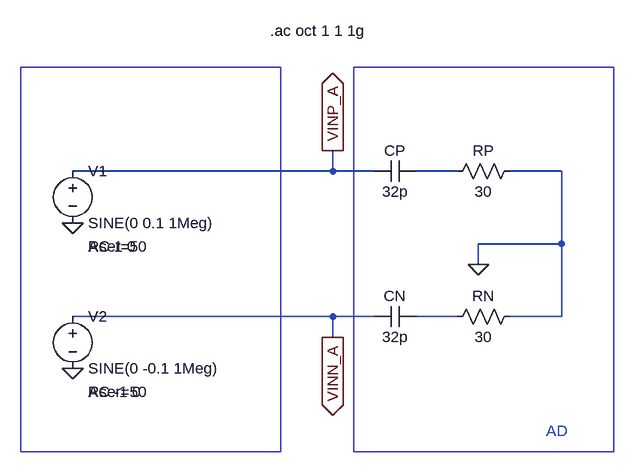
[diagram p0: schematic AD.asc]
AD.asc, the LTspice schematic file:
Version 4
SHEET 1 1456 680
WIRE 592 48 592 16
WIRE 592 48 192 48
WIRE 656 48 592 48
WIRE 784 48 720 48
WIRE 944 48 864 48
WIRE 944 160 944 48
WIRE 944 160 816 160
WIRE 816 192 816 160
WIRE 592 272 192 272
WIRE 656 272 592 272
WIRE 784 272 720 272
WIRE 944 272 944 160
WIRE 944 272 864 272
WIRE 592 304 592 272
FLAG 592 304 VINN_A
IOPIN 592 304 Out
FLAG 592 16 VINP_A
IOPIN 592 16 Out
FLAG 816 192 0
FLAG 192 128 0
FLAG 192 352 0
SYMBOL cap 720 32 R90
WINDOW 0 0 32 VBottom 0
WINDOW 3 32 32 VTop 0
SYMATTR InstName CP
SYMATTR Value 32p
SYMBOL res 880 32 R90
WINDOW 0 0 56 VBottom 0
WINDOW 3 32 56 VTop 0
SYMATTR InstName RP
SYMATTR Value 30
SYMATTR SpiceLine tol=1 pwr=0.1
SYMBOL cap 720 256 R90
WINDOW 0 0 32 VBottom 0
WINDOW 3 32 32 VTop 0
SYMATTR InstName CN
SYMATTR Value 32p
SYMBOL voltage 192 32 R0
WINDOW 123 24 132 Left 0
WINDOW 39 24 132 Left 0
SYMATTR Value2 AC 1 0
SYMATTR SpiceLine Rser=50
SYMATTR InstName V1
SYMATTR Value SINE(0 0.1 1Meg)
SYMBOL res 880 256 R90
WINDOW 0 0 56 VBottom 0
WINDOW 3 32 56 VTop 0
SYMATTR InstName RN
SYMATTR Value 30
SYMBOL voltage 192 256 R0
WINDOW 123 24 132 Left 0
WINDOW 39 24 132 Left 0
SYMATTR Value2 AC -1 0
SYMATTR SpiceLine Rser=50
SYMATTR InstName V2
SYMATTR Value SINE(0 -0.1 1Meg)
TEXT 496 -168 Left 0 !.ac oct 1 1 1g
TEXT 920 448 Left 0 ;AD
RECTANGLE Normal 624 480 1024 -112
RECTANGLE Normal 112 480 512 -112

The netlist it stands for:
* AD.asc
CP N001 VINP_A 32p
RP 0 N001 30 tol=1 pwr=0.1
CN N002 VINN_A 32p
V1 VINP_A 0 SINE(0 0.1 1Meg) AC 1 0 Rser=50
RN 0 N002 30
V2 VINN_A 0 SINE(0 -0.1 1Meg) AC -1 0 Rser=50
.ac oct 1 1 1g
* AD
.backanno
.end